# EAGLE design control (EAGLE 7.5.0)
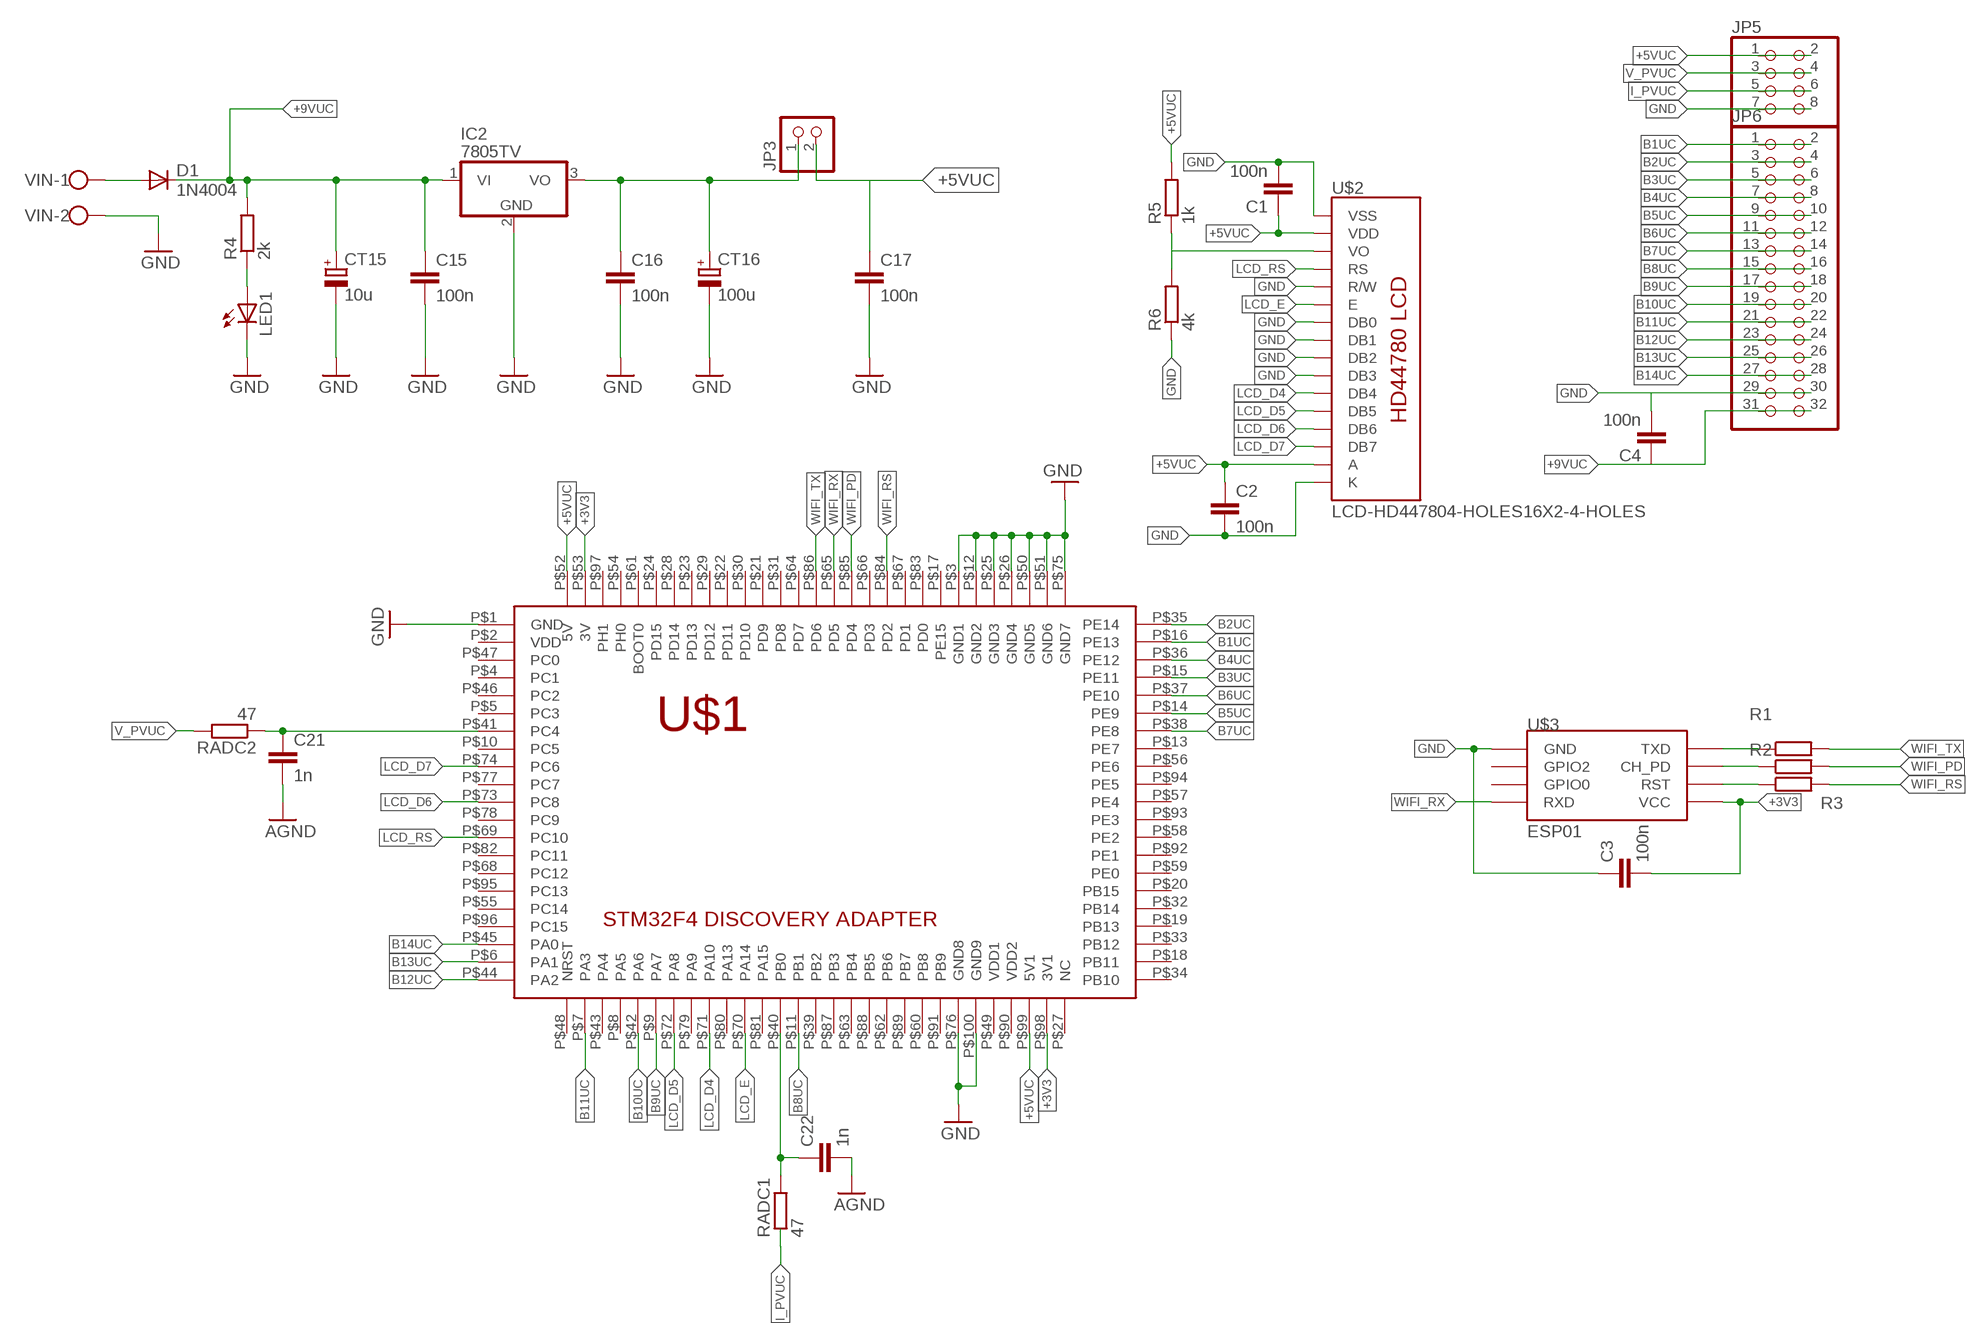
[diagram p0: schematic, sheet 1]

## Parts
C1  100n  C-EUC1206  [C1206]
C2  100n  C-EUC1206  [C1206]
C3  100n  C-EUC1206  [C1206]
C4  100n  C-EUC1206  [C1206]
C15  100n  C-EUC1206  [C1206]
C16  100n  C-EUC1206  [C1206]
C17  100n  C-EUC1206  [C1206]
C21  1n  C-EUC1206  [C1206]
C22  1n  C-EUC1206  [C1206]
CT15  10u  CPOL-EUB/3528-21W  [B/3528-21W]
CT16  100u  CPOL-EUD/7343-31R  [D/7343-31R]
D1  1N4004  [DO214AC]
IC2  7805TV  [TO220V]
JP3  PINHD-1X2  [1X02]
JP5  PINHD-2X4/90  [2X04/90]
JP6  PINHD-2X16/90  [2X16/90]
LED1  LEDCHIPLED_0805  [CHIPLED_0805]
R1  R-EU_R0603  [R0603]
R2  R-EU_R0603  [R0603]
R3  R-EU_R0603  [R0603]
R4  2k  R-EU_M1206  [M1206]
R5  1k  R-EU_M1206  [M1206]
R6  4k  R-EU_M1206  [M1206]
RADC1  47  R-EU_R1206  [R1206]
RADC2  47  R-EU_R1206  [R1206]
U$1  STM32F4ADAPTER  [DISCOVERYPACK]
U$2  LCD-HD447804-HOLES16X2-4-HOLES  [LCD-16X2-4HOLES]
U$3  ESP01  [ESP01]
VIN  W237-102  [W237-102]

## Nets
+3V3: C3.2 U$1.P$53(3V) U$1.P$98(3V1) U$3.VCC
+5VUC: C1.1 C2.1 C17.1 JP3.2 JP5.1 JP5.2 R5.2 U$1.P$52(5V) U$1.P$99(5V1) U$2.2(VDD) U$2.15(A)
+9VUC: C4.1 C15.1 CT15.+ D1.C IC2.1(VI) JP6.31 JP6.32 R4.2
B1UC: JP6.1 JP6.2 U$1.P$16(PE13)
B2UC: JP6.3 JP6.4 U$1.P$35(PE14)
B3UC: JP6.5 JP6.6 U$1.P$15(PE11)
B4UC: JP6.7 JP6.8 U$1.P$36(PE12)
B5UC: JP6.9 JP6.10 U$1.P$14(PE9)
B6UC: JP6.11 JP6.12 U$1.P$37(PE10)
B7UC: JP6.13 JP6.14 U$1.P$38(PE8)
B8UC: JP6.15 JP6.16 U$1.P$11(PB1)
B9UC: JP6.17 JP6.18 U$1.P$9(PA7)
B10UC: JP6.19 JP6.20 U$1.P$42(PA6)
B11UC: JP6.21 JP6.22 U$1.P$7(PA3)
B12UC: JP6.23 JP6.24 U$1.P$44(PA2)
B13UC: JP6.25 JP6.26 U$1.P$6(PA1)
B14UC: JP6.27 JP6.28 U$1.P$45(PA0)
GND: C1.2 C2.2 C3.1 C4.2 C15.2 C16.2 C17.2 C21.2 C22.2 CT15.- CT16.- IC2.2(GND) JP5.7 JP5.8 JP6.29 JP6.30 LED1.C R6.1 U$1.P$1(GND) U$1.P$3(GND1) U$1.P$12(GND2) U$1.P$25(GND3) U$1.P$26(GND4) U$1.P$50(GND5) U$1.P$51(GND6) U$1.P$75(GND7) U$1.P$76(GND8) U$1.P$100(GND9) U$2.1(VSS) U$2.5(R/W) U$2.7(DB0) U$2.8(DB1) U$2.9(DB2) U$2.10(DB3) U$2.16(K) U$3.GND VIN.2 ; supply symbol labelled AGND
I_PVUC: JP5.5 JP5.6 RADC1.1
LCD_D4: U$1.P$71(PA10) U$2.11(DB4)
LCD_D5: U$1.P$72(PA8) U$2.12(DB5)
LCD_D6: U$1.P$73(PC8) U$2.13(DB6)
LCD_D7: U$1.P$74(PC6) U$2.14(DB7)
LCD_E: U$1.P$70(PA14) U$2.6(E)
LCD_RS: U$1.P$69(PC10) U$2.4(RS)
N$1: R1.1 U$3.TX(TXD)
N$2: R2.1 U$3.CH_PD
N$3: R3.1 U$3.RST
N$32: C22.1 RADC1.2 U$1.P$40(PB0)
N$36: LED1.A R4.1
N$37: C16.1 CT16.+ IC2.3(VO) JP3.1
N$38: R5.1 R6.2 U$2.3(VO)
N$39: D1.A VIN.1
N$41: C21.1 RADC2.1 U$1.P$41(PC4)
V_PVUC: JP5.3 JP5.4 RADC2.2
WIFI_PD: R2.2 U$1.P$85(PD4)
WIFI_RS: R3.2 U$1.P$84(PD2)
WIFI_RX: U$1.P$65(PD5) U$3.RX(RXD)
WIFI_TX: R1.2 U$1.P$86(PD6)
Unconnected: U$1.P$2(VDD) U$1.P$4(PC1) U$1.P$5(PC3) U$1.P$8(PA5) U$1.P$10(PC5) U$1.P$13(PE7) U$1.P$17(PE15) U$1.P$18(PB11) U$1.P$19(PB13) U$1.P$20(PB15) U$1.P$21(PD9) U$1.P$22(PD11) U$1.P$23(PD13) U$1.P$24(PD15) U$1.P$27(NC) U$1.P$28(PD14) U$1.P$29(PD12) U$1.P$30(PD10) U$1.P$31(PD8) U$1.P$32(PB14) U$1.P$33(PB12) U$1.P$34(PB10) U$1.P$39(PB2) U$1.P$43(PA4) U$1.P$46(PC2) U$1.P$47(PC0) U$1.P$48(NRST) U$1.P$49(VDD1) U$1.P$54(PH0) U$1.P$55(PC14) U$1.P$56(PE6) U$1.P$57(PE4) U$1.P$58(PE2) U$1.P$59(PE0) U$1.P$60(PB8) U$1.P$61(BOOT0) U$1.P$62(PB6) U$1.P$63(PB4) U$1.P$64(PD7) U$1.P$66(PD3) U$1.P$67(PD1) U$1.P$68(PC12) U$1.P$77(PC7) U$1.P$78(PC9) U$1.P$79(PA9) U$1.P$80(PA13) U$1.P$81(PA15) U$1.P$82(PC11) U$1.P$83(PD0) U$1.P$87(PB3) U$1.P$88(PB5) U$1.P$89(PB7) U$1.P$90(VDD2) U$1.P$91(PB9) U$1.P$92(PE1) U$1.P$93(PE3) U$1.P$94(PE5) U$1.P$95(PC13) U$1.P$96(PC15) U$1.P$97(PH1) U$3.GPIO0 U$3.GPIO2

## Library data of the parts
C1-C4 C15-C17 C21 C22 = resistor:C-EU: CAPACITOR, European symbol
CT15 CT16 = resistor:CPOL-EU: POLARIZED CAPACITOR, European symbol
D1 = diode:1N4004: DIODE general purpose rectifier, 1 A
IC2 = linear:78*: Positive VOLTAGE REGULATOR Source: http://cache.national.com/ds/LM/LM78L05.pdf http://www.fairchildsemi.com/ds/LM/LM7805.pdf
JP3 = pinhead:PINHD-1X2: PIN HEADER
JP5 = pinhead:PINHD-2X4: PIN HEADER
JP6 = pinhead:PINHD-2X16: PIN HEADER
LED1 = led:LED: LED OSRAM: - CHIPLED LG R971, LG N971, LY N971, LG Q971, LY Q971, LO R971, LY R971 LH N974, LH R974 LS Q976, LO Q976, LY Q976 LO Q996 - Hyper CHIPLED LW Q18S LB Q993, LB Q99A, LB R99A - SideLED LS A670, LO A670, LY A670, LG A670, LP A670 LB A673, LV A673, LT A673, LW A673 LH A674 LY A675 LS A676, LA A676, LO A676, LY A676, LW A676 LS A679, LY A679, LG A679 - Hyper Micro SIDELED® LS Y876, LA Y876, LO Y876, LY Y876 LT Y87S - SmartLED LW L88C, LW L88S LB L89C, LB L89S, LG L890 LS L89K, LO L89K, LY L89K LS L896, LA L896, LO L896, LY L896 - TOPLED LS T670, LO T670, LY T670, LG T670, LP T670 LSG T670, LSP T670, LSY T670, LOP T670, LYG T670 LG T671, LOG T671, LSG T671 LB T673, LV T673, LT T673, LW T673 LH T674 LS T676, LA T676, LO T676, LY T676, LB T676, LH T676, LSB T676, LW T676 LB T67C, LV T67C, LT T67C, LS T67K, LO T67K, LY T67K, LW E67C LS E67B, LA E67B, LO E67B, LY E67B, LB E67C, LV E67C, LT E67C LW T67C LS T679, LY T679, LG T679 LS T770, LO T770, LY T770, LG T770, LP T770 LB T773, LV T773, LT T773, LW T773 LH T774 LS E675, LA E675, LY E675, LS T675 LS T776, LA T776, LO T776, LY T776, LB T776 LHGB T686 LT T68C, LB T68C - Hyper Mini TOPLED® LB M676 - Mini TOPLED Santana® LG M470 LS M47K, LO M47K, LY M47K Source: http://www.osram.convergy.de LUXEON: - LUMILED® LXK2-PW12-R00, LXK2-PW12-S00, LXK2-PW14-U00, LXK2-PW14-V00 LXK2-PM12-R00, LXK2-PM12-S00, LXK2-PM14-U00 LXK2-PE12-Q00, LXK2-PE12-R00, LXK2-PE12-S00, LXK2-PE14-T00, LXK2-PE14-U00 LXK2-PB12-K00, LXK2-PB12-L00, LXK2-PB12-M00, LXK2-PB14-N00, LXK2-PB14-P00, LXK2-PB14-Q00 LXK2-PR12-L00, LXK2-PR12-M00, LXK2-PR14-Q00, LXK2-PR14-R00 LXK2-PD12-Q00, LXK2-PD12-R00, LXK2-PD12-S00 LXK2-PH12-R00, LXK2-PH12-S00 LXK2-PL12-P00, LXK2-PL12-Q00, LXK2-PL12-R00 Source: www.luxeon.com KINGBRIGHT: KA-3528ASYC Source: www.kingbright.com
R1-R6 RADC1 RADC2 = resistor:R-EU_: RESISTOR, European symbol
U$1 = stm32:STM32F4ADAPTER: This is a STM32F4 discovery board PCB adapter, Made by: Aounallah Mazen email: aounallah.mazen@gmail.com 04/01/2014
U$2 = HD44780LCD:LCD-HD44780
U$3 = esp8266modules:ESP01: ESP8266 Wifi module 01
VIN = con-wago-500:W237-102: WAGO SCREW CLAMP; MPN: 237-102; OC_FARNELL: unknown; OC_NEWARK: 70K9898

## Board
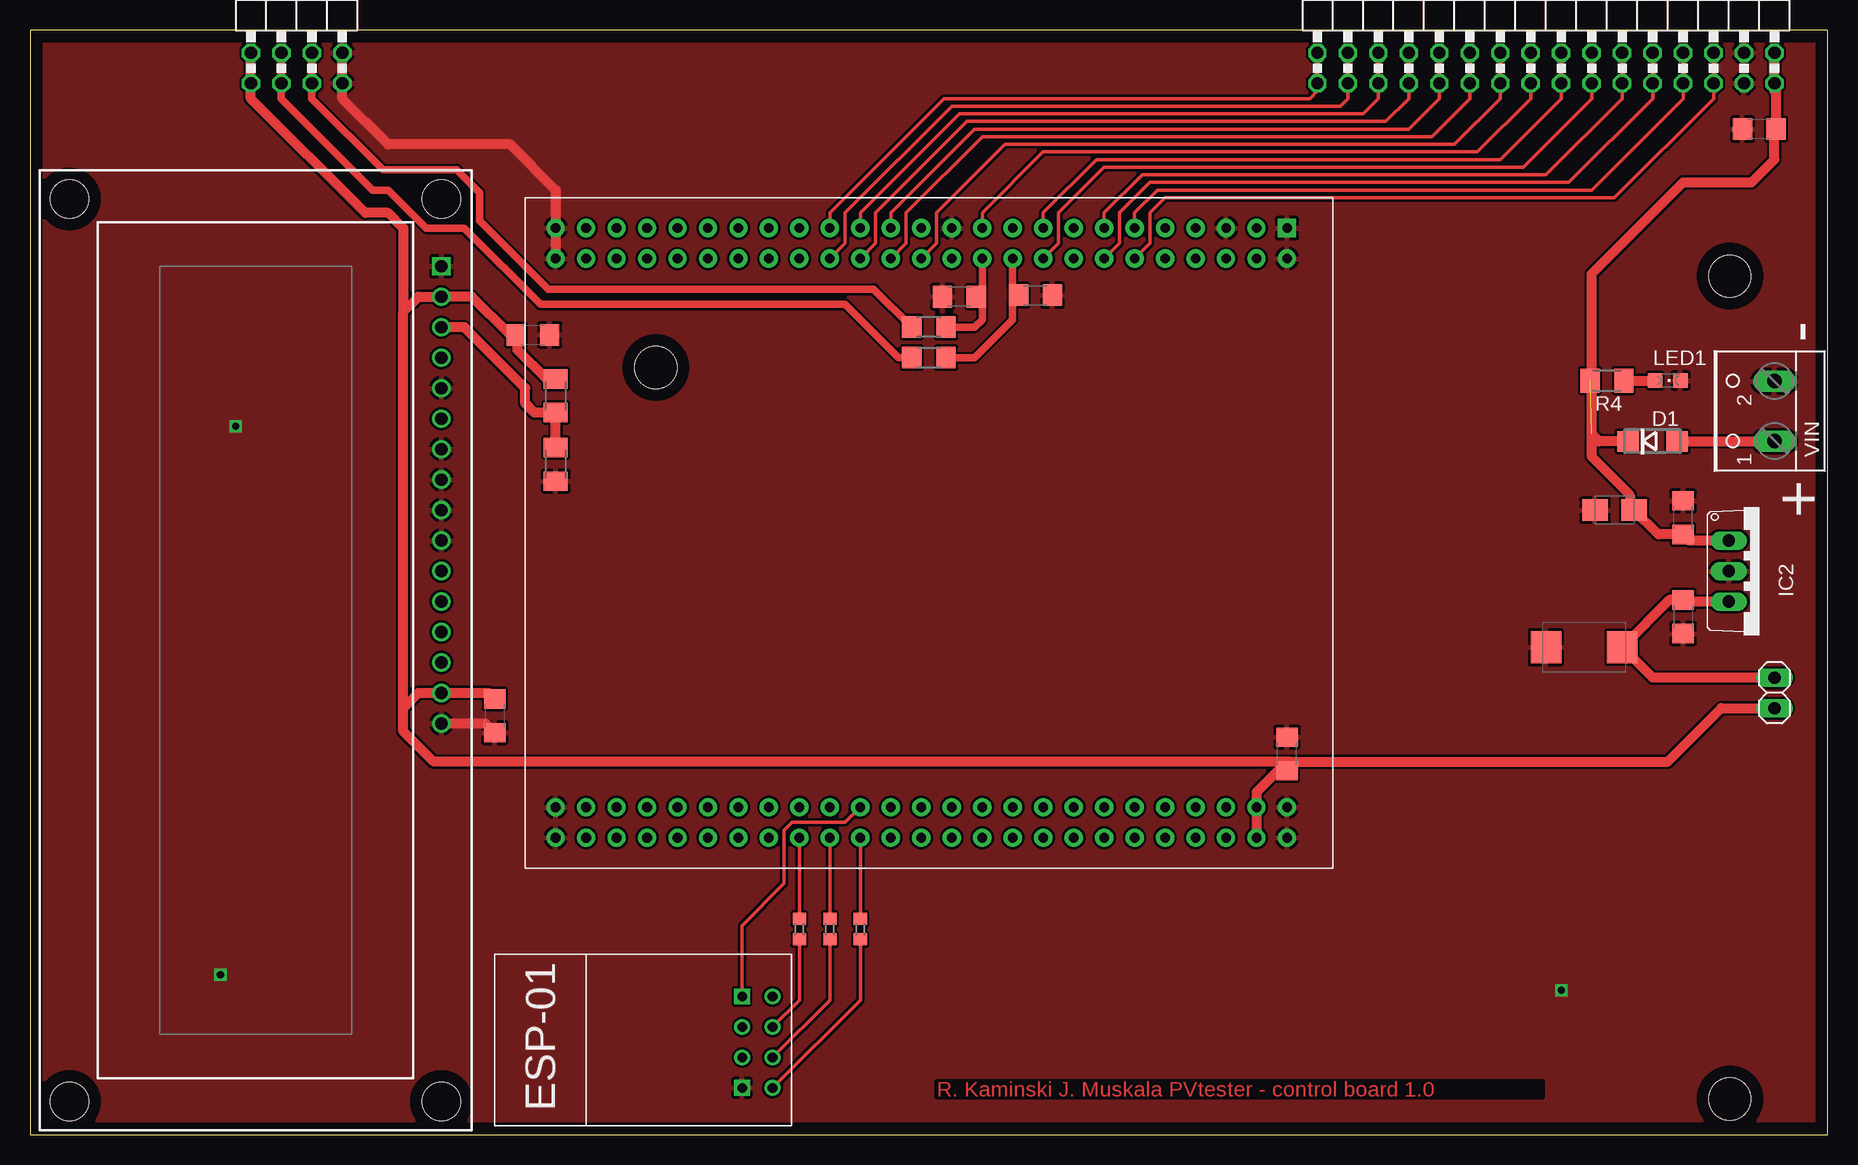
[diagram p1: board, top side]
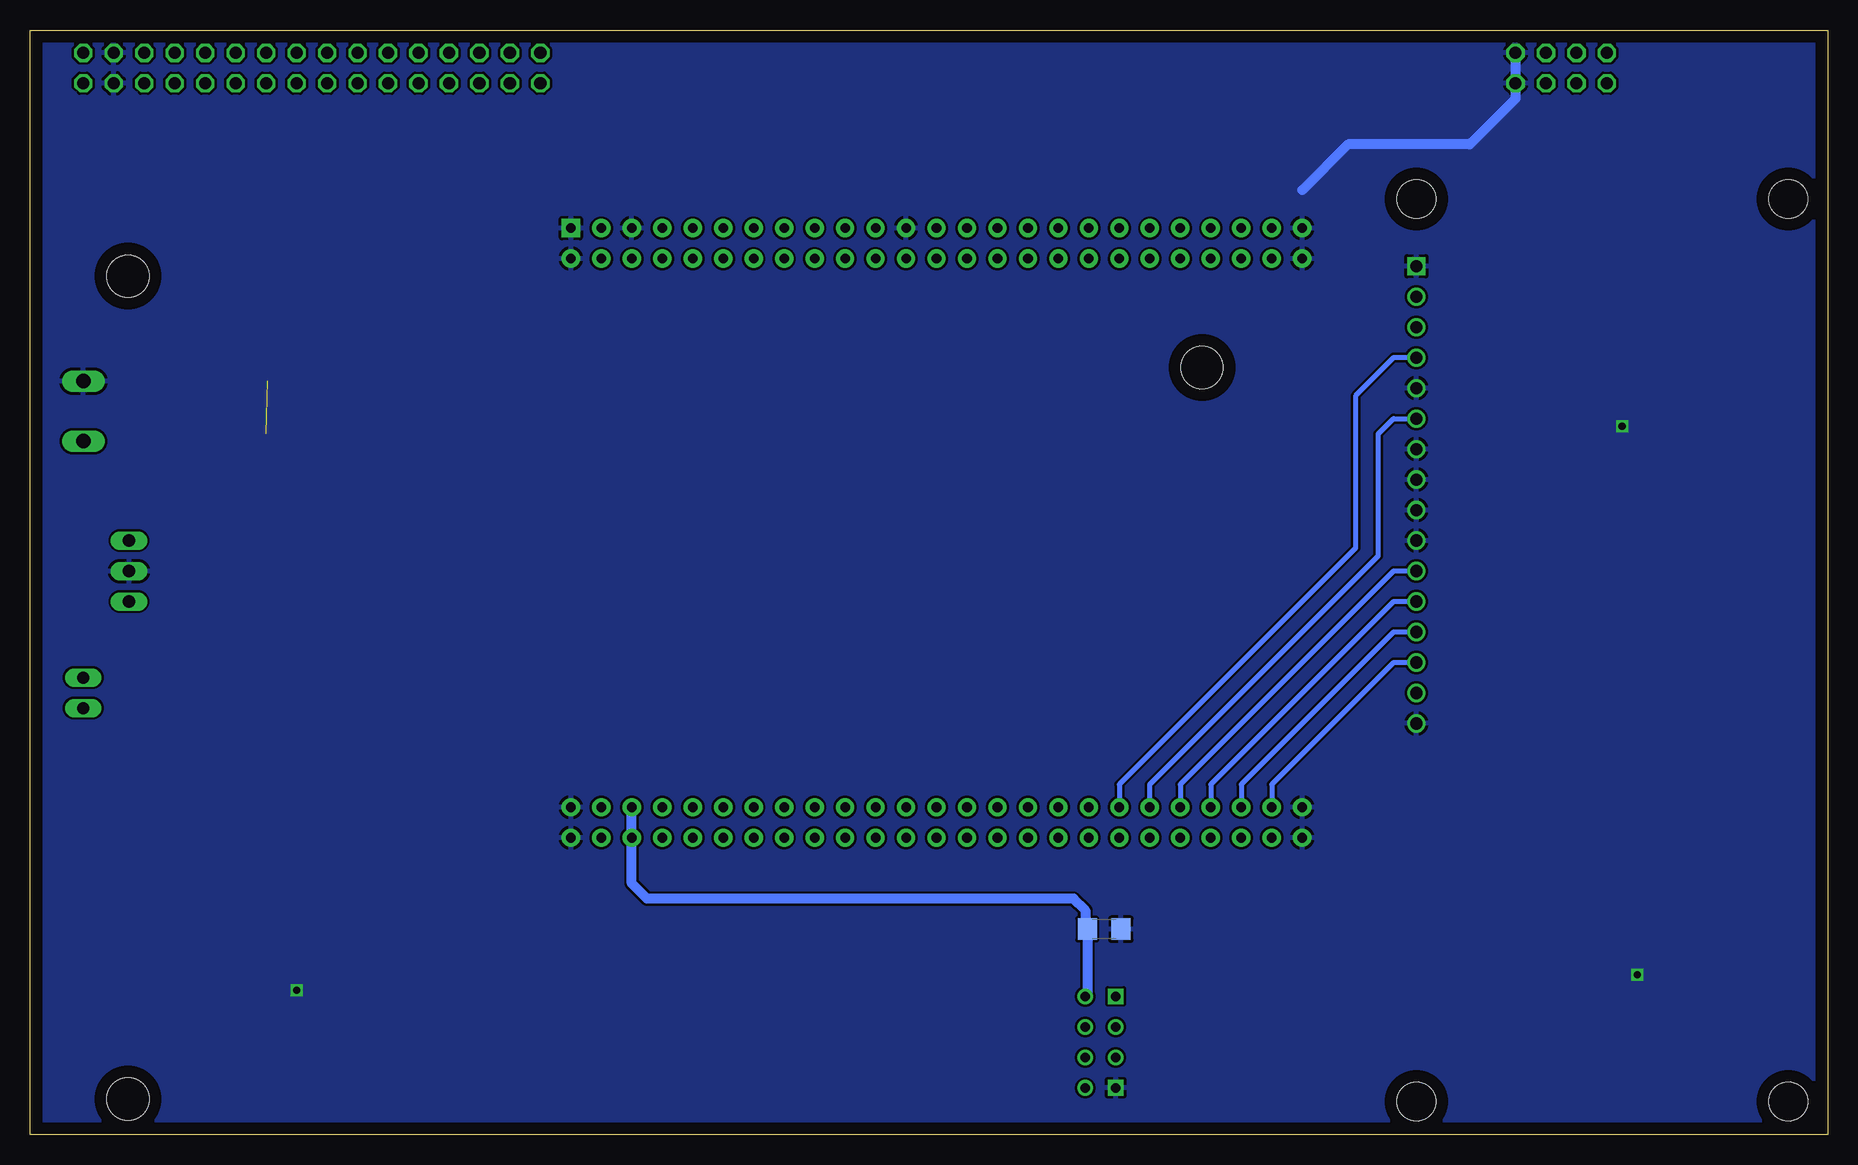
[diagram p2: board, bottom side, seen from below]

Size 149.86 x 92.08 mm. Coordinates in mm from the lower left corner, seen from the top.
Outline: 0,0 149.86,0 149.86,92.08 0,92.08 0,0
Copper layers (1*16): Top 0.035mm / dielectric 1.5mm / Bottom 0.035mm
Design rules "default *": minimum track width 8mil, minimum drill 0.3mm, track to track 8mil, track to pad 8mil, pad to pad 8mil, via to via 8mil, smd to smd 8mil, copper to edge 40mil, drill to drill 8mil, minimum pad ring 10mil, minimum via ring 8mil, stop-mask expansion 4mil, vias tented up to drill 0mil, thermal gap 10mil
Holes 3.5 mm at 52.17,63.94 141.7,71.56 141.7,2.98

### Footprints (pad centres in the part's own frame; a part is rotated, then mirrored left to right if it is on the bottom)
C1206 = smd 1.6 x 1.8: 1 -1.4,0; 2 1.4,0
B/3528-21W = smd 2.15 x 1.8: + 1.625,0; - -1.625,0
D/7343-31R = smd 2.55 x 2.7: + 3.175,0; - -3.175,0
DO214AC = smd 1.8 x 1.7: A 2.05,0; C -2.05,0
TO220V = drill 1.016 long: 1 -2.54,-2.54; 2 0,-2.54; 3 2.54,-2.54
1X02 = drill 1.016 long: 1 -1.27,0; 2 1.27,0
2X04/90 = drill 1.016 octagon: 1 -3.81,-6.35; 2 -3.81,-3.81; 3 -1.27,-6.35; 4 -1.27,-3.81; 5 1.27,-6.35; 6 1.27,-3.81; 7 3.81,-6.35; 8 3.81,-3.81
2X16/90 = drill 1.016 octagon: 1 -19.05,-6.35; 2 -19.05,-3.81; 3 -16.51,-6.35; 4 -16.51,-3.81; 5 -13.97,-6.35; 6 -13.97,-3.81; 7 -11.43,-6.35; 8 -11.43,-3.81; 9 -8.89,-6.35; 10 -8.89,-3.81; 11 -6.35,-6.35; 12 -6.35,-3.81; 13 -3.81,-6.35; 14 -3.81,-3.81; 15 -1.27,-6.35; 16 -1.27,-3.81; 17 1.27,-6.35; 18 1.27,-3.81; 19 3.81,-6.35; 20 3.81,-3.81; 21 6.35,-6.35; 22 6.35,-3.81; 23 8.89,-6.35; 24 8.89,-3.81; 25 11.43,-6.35; 26 11.43,-3.81; 27 13.97,-6.35; 28 13.97,-3.81; 29 16.51,-6.35; 30 16.51,-3.81; 31 19.05,-6.35; 32 19.05,-3.81
CHIPLED_0805 = smd 1.2 x 1.2: A 0,-1.05; C 0,1.05
R0603 = smd 1 x 1.1: 1 -0.85,0; 2 0.85,0
M1206 = smd 1.6 x 2: 1 -1.4,0; 2 1.4,0
R1206 = smd 1.6 x 1.803: 1 -1.422,0; 2 1.422,0
DISCOVERYPACK = drill 0.8 pad 1.524 square: P$1 0,0 | drill 0.8 pad 1.524: P$2 0,-2.54; P$3 0,-5.08; P$4 0,-7.62; P$5 0,-10.16; P$6 0,-12.7; P$7 0,-15.24; P$8 0,-17.78; P$9 0,-20.32; P$10 0,-22.86; P$11 0,-25.4; P$12 0,-27.94; P$13 0,-30.48; P$14 0,-33.02; P$15 0,-35.56; P$16 0,-38.1; P$17 0,-40.64; P$18 0,-43.18; P$19 0,-45.72; P$20 0,-48.26; P$21 0,-50.8; P$22 0,-53.34; P$23 0,-55.88; P$24 0,-58.42; P$25 0,-60.96; P$26 2.54,-60.96; P$27 2.54,-58.42; P$28 2.54,-55.88; P$29 2.54,-53.34; P$30 2.54,-50.8; P$31 2.54,-48.26; P$32 2.54,-45.72; P$33 2.54,-43.18; P$34 2.54,-40.64; P$35 2.54,-38.1; P$36 2.54,-35.56; P$37 2.54,-33.02; P$38 2.54,-30.48; P$39 2.54,-27.94; P$40 2.54,-25.4; P$41 2.54,-22.86; P$42 2.54,-20.32; P$43 2.54,-17.78; P$44 2.54,-15.24; P$45 2.54,-12.7; P$46 2.54,-10.16; P$47 2.54,-7.62; P$48 2.54,-5.08; P$49 2.54,-2.54; P$50 2.54,0; P$51 48.26,0; P$52 48.26,-2.54; P$53 48.26,-5.08; P$54 48.26,-7.62; P$55 48.26,-10.16; P$56 48.26,-12.7; P$57 48.26,-15.24; P$58 48.26,-17.78; P$59 48.26,-20.32; P$60 48.26,-22.86; P$61 48.26,-25.4; P$62 48.26,-27.94; P$63 48.26,-30.48; P$64 48.26,-33.02; P$65 48.26,-35.56; P$66 48.26,-38.1; P$67 48.26,-40.64; P$68 48.26,-43.18; P$69 48.26,-45.72; P$70 48.26,-48.26; P$71 48.26,-50.8; P$72 48.26,-53.34; P$73 48.26,-55.88; P$74 48.26,-58.42; P$75 48.26,-60.96; P$76 50.8,-60.96; P$77 50.8,-58.42; P$78 50.8,-55.88; P$79 50.8,-53.34; P$80 50.8,-50.8; P$81 50.8,-48.26; P$82 50.8,-45.72; P$83 50.8,-43.18; P$84 50.8,-40.64; P$85 50.8,-38.1; P$86 50.8,-35.56; P$87 50.8,-33.02; P$88 50.8,-30.48; P$89 50.8,-27.94; P$90 50.8,-25.4; P$91 50.8,-22.86; P$92 50.8,-20.32; P$93 50.8,-17.78; P$94 50.8,-15.24; P$95 50.8,-12.7; P$96 50.8,-10.16; P$97 50.8,-7.62; P$98 50.8,-5.08; P$99 50.8,-2.54; P$100 50.8,0
LCD-16X2-4HOLES = drill 1.016 square: 1 -32,15.5 | drill 1.016: 2 -29.46,15.5; 3 -26.92,15.5; 4 -24.38,15.5; 5 -21.84,15.5; 6 -19.3,15.5; 7 -16.76,15.5; 8 -14.22,15.5; 9 -11.68,15.5; 10 -9.14,15.5; 11 -6.6,15.5; 12 -4.06,15.5; 13 -1.52,15.5; 14 1.02,15.5; 15 3.56,15.5; 16 6.1,15.5 | hole 3.2: -37.6,15.5; -37.6,-15.5; 37.6,-15.5; 37.6,15.5
ESP01 = drill 0.8: CH_PD -1.285,-8.178; GPIO0 1.255,-5.638; GPIO2 -1.285,-5.638; RST 1.255,-8.178; TX -3.825,-8.178; VCC 3.795,-8.178 | drill 0.8 square: GND -3.825,-5.638; RX 3.795,-5.638
W237-102 = drill 1.194 long: 1 -2.5,-1.27; 2 2.5,-1.27

### Placement (x,y rotation side)
C1  38.73,34.92 270 top
C2  41.91,66.67 0 top
C3  60.33,17.14 180 bottom
C4  144.14,83.82 180 top
C15  137.79,51.44 90 top
C16  137.79,43.18 270 top
C17  104.78,31.75 90 top
C21  83.82,69.98 0 top
C22  77.47,69.85 180 top
CT15  132.08,52.07 0 top
CT16  129.54,40.64 0 top
D1  135.25,57.78 0 top
IC2  144.14,46.99 270 top
JP3  145.41,36.83 270 top
JP5  22.22,93.98 0 top
JP6  126.36,93.98 0 top
LED1  136.52,62.86 270 top
R1  69.22,17.14 90 top
R2  66.67,17.14 90 top
R3  64.14,17.14 90 top
R4  131.44,62.86 180 top
R5  43.82,61.59 90 top
R6  43.82,55.88 90 top
RADC1  74.93,67.31 0 top
RADC2  74.93,64.77 180 top
U$1  104.78,75.56 270 top
U$2  18.8,40.39 270 top
U$3  53.72,7.75 90 top
VIN  144.14,60.32 90 top

### Tracks (layer width: path | path; a pad name or v marks a point on that pad's centre or on a via)
+3V3
  Bottom 0.813: U$1.P$53 U$1.P$98 99.7,20.95 98.42,19.68 62.87,19.68 61.9,18.72 61.9,17.32 C3.2 61.73,11.71 U$3.VCC
+5VUC
  Top 0.813: U$1.P$99 U$1.P$52 102.23,28.57 104.56,30.9 C17.1 104.99,31.12 | JP3.2 140.97,35.56 136.52,31.12 104.99,31.12 | 31.11,68.58 31.11,75.56 29.85,76.83 27.94,76.83 18.41,86.36 JP5.1 JP5.2 | R5.2 43.05,63 40.64,65.41 40.64,66.55 C2.1 40.01,66.67 36.83,69.85 U$2.2 32.39,69.85 31.11,68.58 | 104.99,31.12 33.66,31.12 31.11,33.66 31.11,35.56 | U$2.15 38.23,36.83 C1.1 | 31.11,35.56 32.39,36.83 U$2.15 | U$2.15 | 31.11,35.56 31.11,68.58
+9VUC  (1 unrouted)
  Top 0.813: D1.C 130.81,57.78 130.17,58.42 | 145.41,87 JP6.31 | JP6.31 JP6.32 | 130.17,58.42 130.17,56.52 133.35,53.34 133.35,52.32 CT15.+ 135.74,50.03 C15.1 138.3,49.53 IC2.1 | 130.17,58.42 130.17,71.75 137.79,79.38 143.51,79.38 145.41,81.28 145.41,83.69 C4.1 145.54,87.5 JP6.31
B1UC
  Top 0.305: JP6.1 107.31,87 106.68,86.36 76.2,86.36 66.67,76.83 U$1.P$16
  Top 0.406: JP6.1 JP6.2
B2UC
  Top 0.305: JP6.3 109.86,86.36 109.22,85.72 76.84,85.72 67.95,76.83 67.95,74.3 U$1.P$35
  Top 0.406: JP6.3 JP6.4
B3UC
  Top 0.305: JP6.5 112.39,86.36 111.12,85.09 77.47,85.09 69.22,76.83 U$1.P$15
  Top 0.406: JP6.5 JP6.6
B4UC
  Top 0.305: JP6.7 114.94,86.36 113.03,84.45 78.11,84.45 70.48,76.83 70.48,74.3 U$1.P$36
  Top 0.406: JP6.7 JP6.8
B5UC
  Top 0.305: JP6.9 117.48,86.36 114.94,83.82 78.74,83.82 71.76,76.83 U$1.P$14
  Top 0.406: JP6.9 JP6.10
B6UC
  Top 0.305: JP6.11 120.02,86.36 116.84,83.19 79.38,83.19 73.03,76.83 73.03,74.3 U$1.P$37
  Top 0.406: JP6.11 JP6.12
B7UC
  Top 0.305: JP6.13 122.56,86.36 118.75,82.55 81.28,82.55 75.56,76.83 75.56,74.3 U$1.P$38
  Top 0.406: JP6.13 JP6.14
B8UC
  Top 0.305: JP6.15 125.1,86.36 120.65,81.91 84.45,81.91 79.38,76.83 U$1.P$11
  Top 0.406: JP6.15 JP6.16
B9UC
  Top 0.305: JP6.17 127.64,86.36 122.56,81.28 88.9,81.28 84.45,76.83 U$1.P$9
  Top 0.406: JP6.17 JP6.18
B10UC
  Top 0.305: JP6.19 130.17,86.36 124.46,80.64 89.53,80.64 85.73,76.83 85.73,74.3 U$1.P$42
  Top 0.406: JP6.19 JP6.20
B11UC
  Top 0.305: JP6.21 132.71,86.36 126.36,80.01 92.71,80.01 89.53,76.83 U$1.P$7
  Top 0.406: JP6.22 JP6.21
B12UC
  Top 0.305: JP6.23 135.25,86.36 128.27,79.38 93.34,79.38 90.81,76.83 90.81,74.3 U$1.P$44
  Top 0.406: JP6.24 JP6.23
B13UC
  Top 0.305: JP6.25 137.79,86.36 130.17,78.74 93.98,78.74 92.08,76.83 U$1.P$6
  Top 0.406: JP6.26 JP6.25
B14UC
  Top 0.305: JP6.27 140.33,86.36 132.08,78.11 94.62,78.11 93.34,76.83 93.34,74.3 U$1.P$45
  Top 0.406: JP6.28 JP6.27
GND  (via drill 0.6)
  Top 0.813: JP5.8 JP5.7 26.04,86.36 29.85,82.55 40.01,82.55 43.82,78.74 U$1.P$25 U$1.P$26 | U$2.16 37.97,34.29 C1.2
  Bottom 0.813: JP5.8 JP5.7 26.04,86.36 29.85,82.55 40.01,82.55 43.82,78.74
  other vias: 17.14,59.05 127.64,12.07 15.88,13.34
  pour Bottom: 0.64,91.44 0.64,0.64 149.22,0.64 149.22,91.44
  pour Top: 0.64,91.44 0.64,0.64 149.22,0.64 149.22,91.44
I_PVUC
  Top 0.61: JP5.6 JP5.5 23.5,86.36 29.43,80.43 35.56,80.43 37.47,78.53 37.47,76.2 43.18,70.48 70.33,70.48 RADC1.1
LCD_D4
  Bottom 0.406: U$2.11 36.2,46.99 53.98,29.21 U$1.P$71
LCD_D5
  Bottom 0.406: U$2.12 36.2,44.45 51.44,29.21 U$1.P$72
LCD_D6
  Bottom 0.406: U$2.13 36.2,41.91 48.9,29.21 U$1.P$73
LCD_D7
  Bottom 0.406: U$2.14 36.2,39.37 46.36,29.21 U$1.P$74
LCD_E
  Bottom 0.406: U$1.P$70 56.52,29.21 37.47,48.26 37.47,58.42 36.2,59.69 U$2.6
LCD_RS
  Bottom 0.406: U$2.4 36.2,64.77 39.37,61.59 39.37,48.89 59.05,29.21 U$1.P$69
N$1
  Top 0.305: R1.1 69.22,11.24 U$3.TX
N$2
  Top 0.305: R2.1 66.67,11.24 U$3.CH_PD
N$3
  Top 0.305: R3.1 64.14,11.24 U$3.RST
N$32
  Top 0.61: RADC1.2 78.74,67.31 79.38,67.94 79.38,69.43 C22.1 78.95,70.06 79.38,70.48 U$1.P$40
N$36
  Top 0.813: R4.1 LED1.A
N$37
  Top 0.813: JP3.1 135.25,38.1 CT16.+ | 132.71,41.02 CT16.+ | IC2.3 137.92,44.45 C16.1 136.66,44.58 CT16.+
N$38
  Top 0.813: R6.2 R5.1 42.04,60.2 41.28,60.96 41.28,62.23 36.2,67.31 U$2.3
N$39
  Top 0.813: D1.A 145.38,57.78 VIN.1
N$41
  Top 0.61: RADC2.1 78.74,64.77 81.92,67.94 81.92,69.56 C21.1 82.34,70.06 81.92,70.48 U$1.P$41
V_PVUC
  Top 0.61: JP5.4 JP5.3 20.95,86.36 28.57,78.74 29.85,78.74 33.02,75.56 36.2,75.56 42.55,69.22 67.95,69.22 72.39,64.77 RADC2.2
WIFI_PD
  Top 0.305: R2.2 U$1.P$85
WIFI_RS
  Top 0.305: R3.2 U$1.P$84
WIFI_RX
  Top 0.305: U$1.P$65 67.95,26.04 63.5,26.04 62.87,25.4 62.87,20.95 59.36,17.45 U$3.RX 59.36,11.73
WIFI_TX
  Top 0.305: R1.2 U$1.P$86

### Text on the board
Top: R. Kaminski J. Muskala PVtester - control board 1.0
tNames: - | +